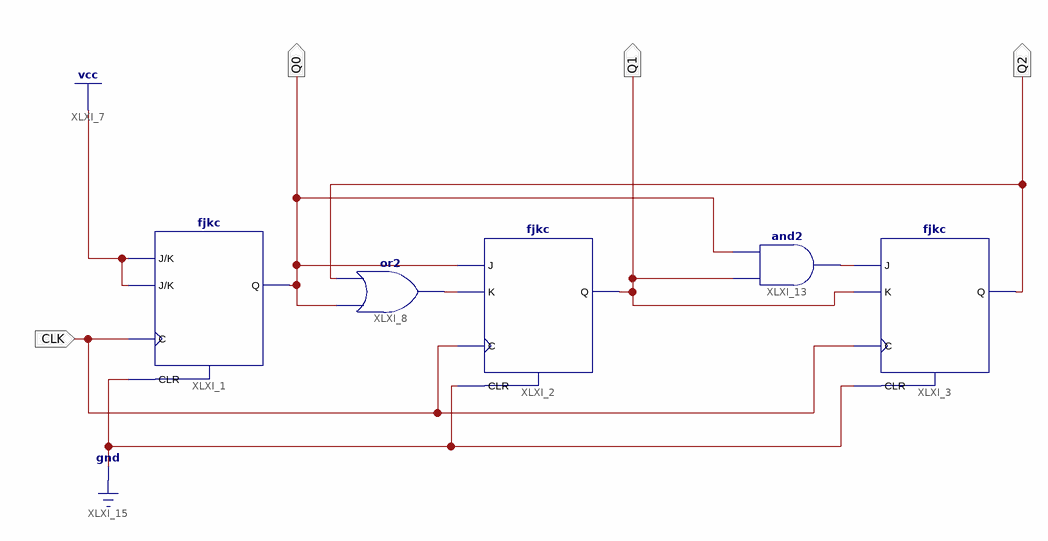
[diagram p0: schematic sheet 1]
// Xilinx ISE schematic mod6.sch (spartan6) as structural Verilog: 5 symbols, 4 ports
module mod6 (
  input  CLK,
  output Q0,
  output Q2,
  output Q1
);

  wire XLXN_6, XLXN_9;

  fjkc XLXI_1 (.C(CLK), .CLR(1'b0), .J(1'b1), .K(1'b1), .Q(Q0));
  or XLXI_8 (XLXN_6, Q0, Q2);
  fjkc XLXI_2 (.C(CLK), .CLR(1'b0), .J(Q0), .K(XLXN_6), .Q(Q1));
  fjkc XLXI_3 (.C(CLK), .CLR(1'b0), .J(XLXN_9), .K(Q1), .Q(Q2));
  and XLXI_13 (XLXN_9, Q1, Q0);
endmodule
